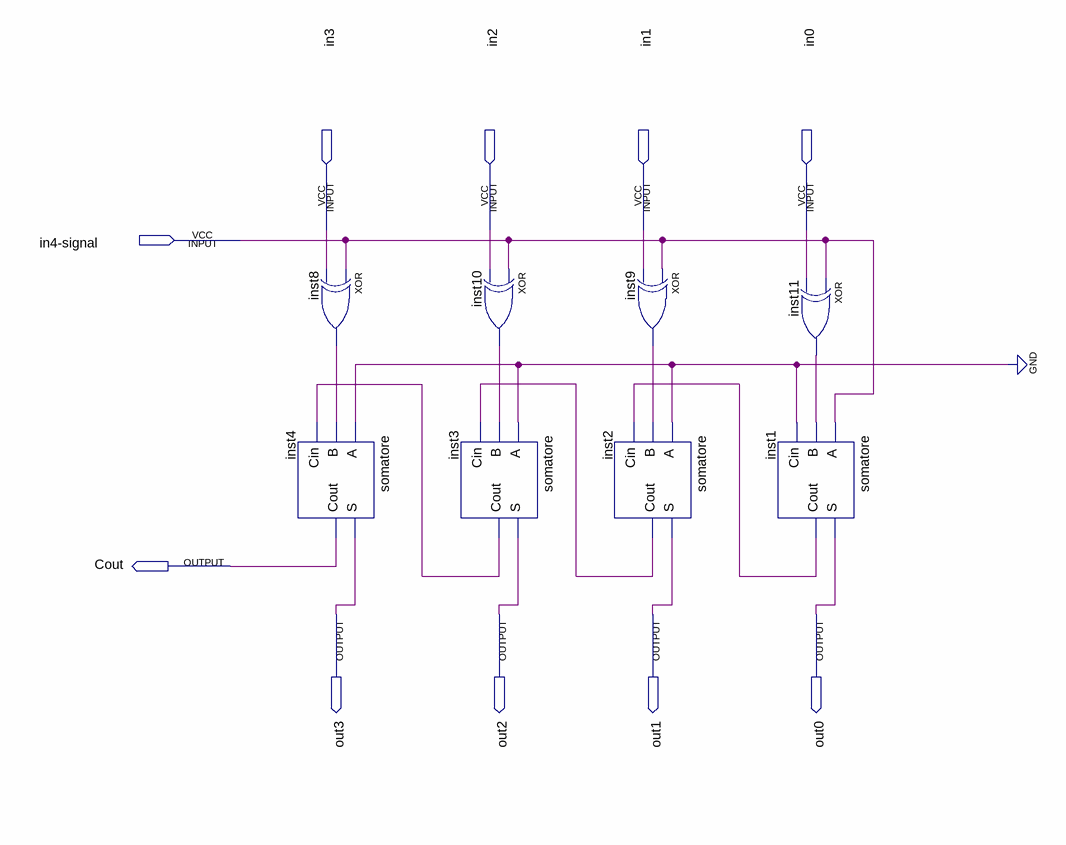
[diagram p0: schematic sheet]
// Quartus schematic comp2_block.bdf as structural Verilog: 8 symbols, 10 pins
module comp2_block (
  input  in3,
  input  in2,
  input  in1,
  input  in0,
  input  \in4-signal ,
  output Cout,
  output out3,
  output out2,
  output out1,
  output out0
);

  wire inst1_cout, inst2_cout, inst3_cout, inst8_out, inst9_out, inst10_out, inst11_out;

  xor inst8 (inst8_out, \in4-signal , in3);
  somatore inst4 (.A(1'b0), .B(inst8_out), .Cin(inst3_cout), .S(out3), .Cout(Cout));
  xor inst10 (inst10_out, \in4-signal , in2);
  somatore inst3 (.A(1'b0), .B(inst10_out), .Cin(inst2_cout), .S(out2), .Cout(inst3_cout));
  xor inst9 (inst9_out, \in4-signal , in1);
  somatore inst2 (.A(1'b0), .B(inst9_out), .Cin(inst1_cout), .S(out1), .Cout(inst2_cout));
  xor inst11 (inst11_out, \in4-signal , in0);
  somatore inst1 (.A(\in4-signal ), .B(inst11_out), .Cin(1'b0), .S(out0), .Cout(inst1_cout));
endmodule
